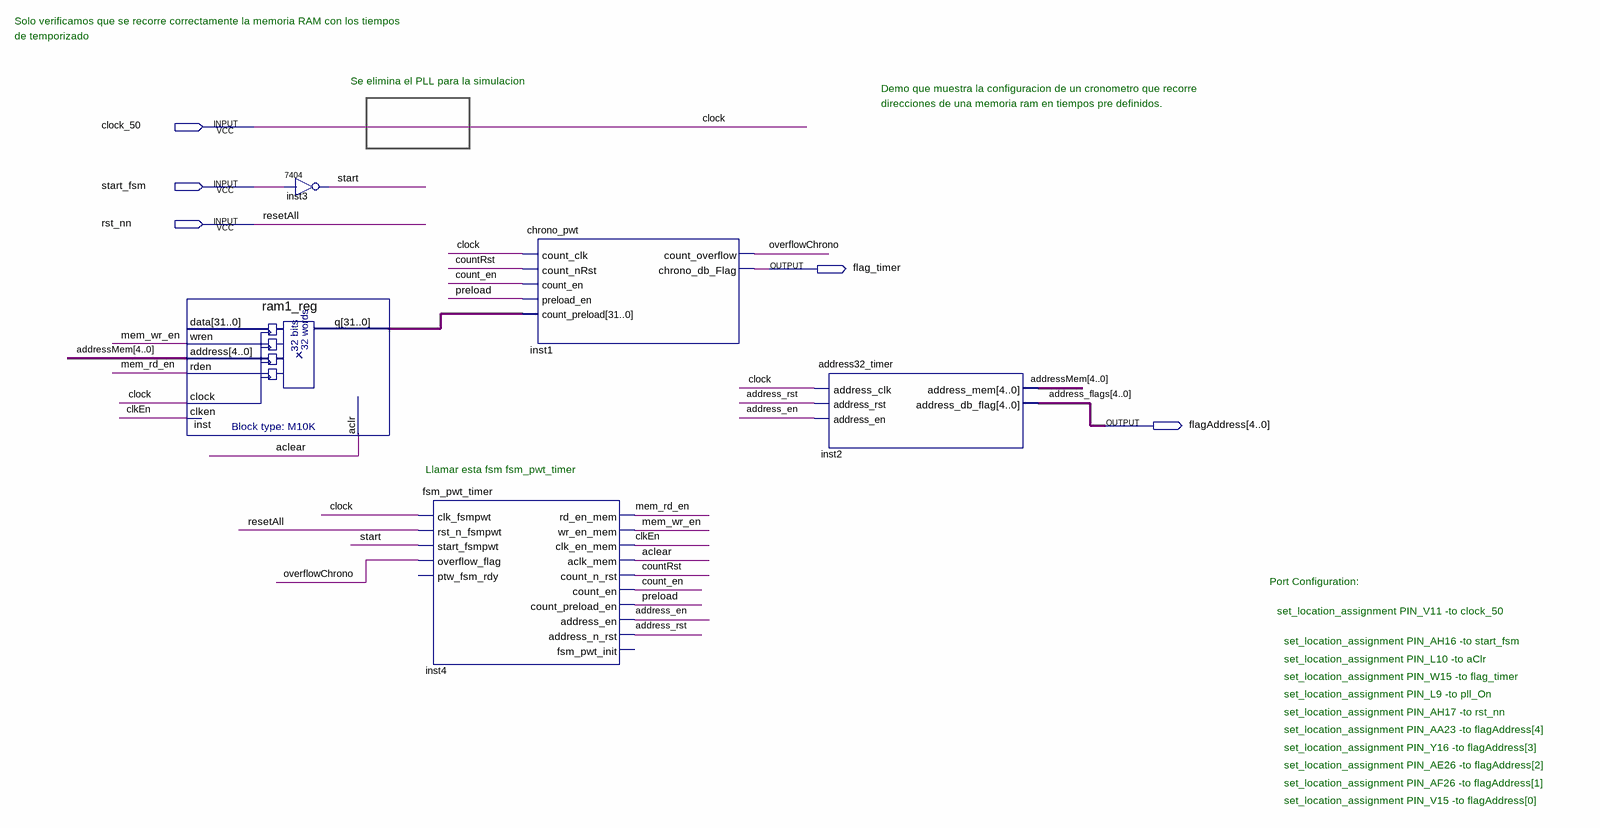
[diagram p0: schematic sheet]
// Quartus schematic chrono_block.bdf as structural Verilog: 5 symbols, 5 pins
module chrono_block (
  input  clock_50,
  input  start_fsm,
  input  rst_nn,
  output flag_timer,
  output [4:0] flagAddress
);

  wire aclear, address_en, address_rst, clkEn, count_en, countRst, mem_rd_en, mem_wr_en, overflowChrono,
       preload, start;
  wire [4:0] addressMem;
  wire [31:0] inst_q;

  ram1_reg inst (
    .wren(mem_wr_en), .address(addressMem), .rden(mem_rd_en), .clock(clock_50), .clken(clkEn), .aclr(aclear),
    .q(inst_q));  // open: data
  \7404  inst3 (.\2 (start_fsm), .\1 (start));
  fsm_pwt_timer inst4 (
    .clk_fsmpwt(clock_50), .rst_n_fsmpwt(rst_nn), .start_fsmpwt(start), .overflow_flag(overflowChrono),
    .rd_en_mem(mem_rd_en), .wr_en_mem(mem_wr_en), .clk_en_mem(clkEn), .aclk_mem(aclear),
    .count_n_rst(countRst), .count_en(count_en), .count_preload_en(preload), .address_en(address_en),
    .address_n_rst(address_rst));  // open: ptw_fsm_rdy, fsm_pwt_init
  chrono_pwt inst1 (
    .count_clk(clock_50), .count_nRst(countRst), .count_en(count_en), .preload_en(preload),
    .count_preload(inst_q), .count_overflow(overflowChrono), .chrono_db_Flag(flag_timer));
  address32_timer inst2 (
    .address_clk(clock_50), .address_rst(address_rst), .address_en(address_en), .address_mem(addressMem),
    .address_db_flag(flagAddress));

  // Other names for the same wires on the sheet: clock = clock_50; address_flags[4:0] = flagAddress;
  //   resetAll = rst_nn

  // Notes on the sheet:
  //   Solo verificamos que se recorre correctamente la memoria RAM con los tiempos
  //   de temporizado
  //   Se elimina el PLL para la simulacion
  //   Demo que muestra la configuracion de un cronometro que recorre 
  //   direcciones de una memoria ram en tiempos pre definidos.
  //   Llamar esta fsm fsm_pwt_timer
  //   Port Configuration:
  //   set_location_assignment PIN_V11 -to clock_50
  //   set_location_assignment PIN_AH16 -to start_fsm
  //   set_location_assignment PIN_L10 -to aClr
  //   set_location_assignment PIN_W15 -to flag_timer
  //   set_location_assignment PIN_L9 -to pll_On
  //   set_location_assignment PIN_AH17 -to rst_nn
  //   set_location_assignment PIN_AA23 -to flagAddress[4]
  //   set_location_assignment PIN_Y16 -to flagAddress[3]
  //   set_location_assignment PIN_AE26 -to flagAddress[2]
  //   set_location_assignment PIN_AF26 -to flagAddress[1]
  //   set_location_assignment PIN_V15 -to flagAddress[0]
endmodule
